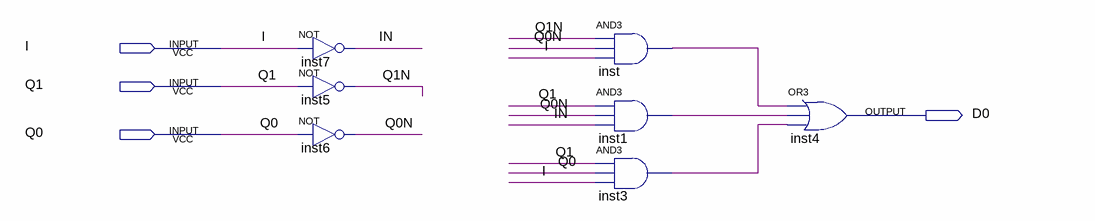
[diagram p0: schematic sheet]
// Quartus schematic D0.bdf as structural Verilog: 7 symbols, 4 pins
module D0 (
  input  I,
  input  Q1,
  input  Q0,
  output D0
);

  wire IN, inst1_out, inst3_out, inst_out, Q0N, Q1N;

  not inst7 (IN, I);
  not inst5 (Q1N, Q1);
  not inst6 (Q0N, Q0);
  and inst (inst_out, Q1N, Q0N, I);
  and inst1 (inst1_out, Q1, Q0N, IN);
  and inst3 (inst3_out, Q1, Q0, I);
  or inst4 (D0, inst_out, inst1_out, inst3_out);
endmodule
